# Altium schematic sheet LED Control A0-A3.SchDoc
size A4; Author: Karol Maciaszek
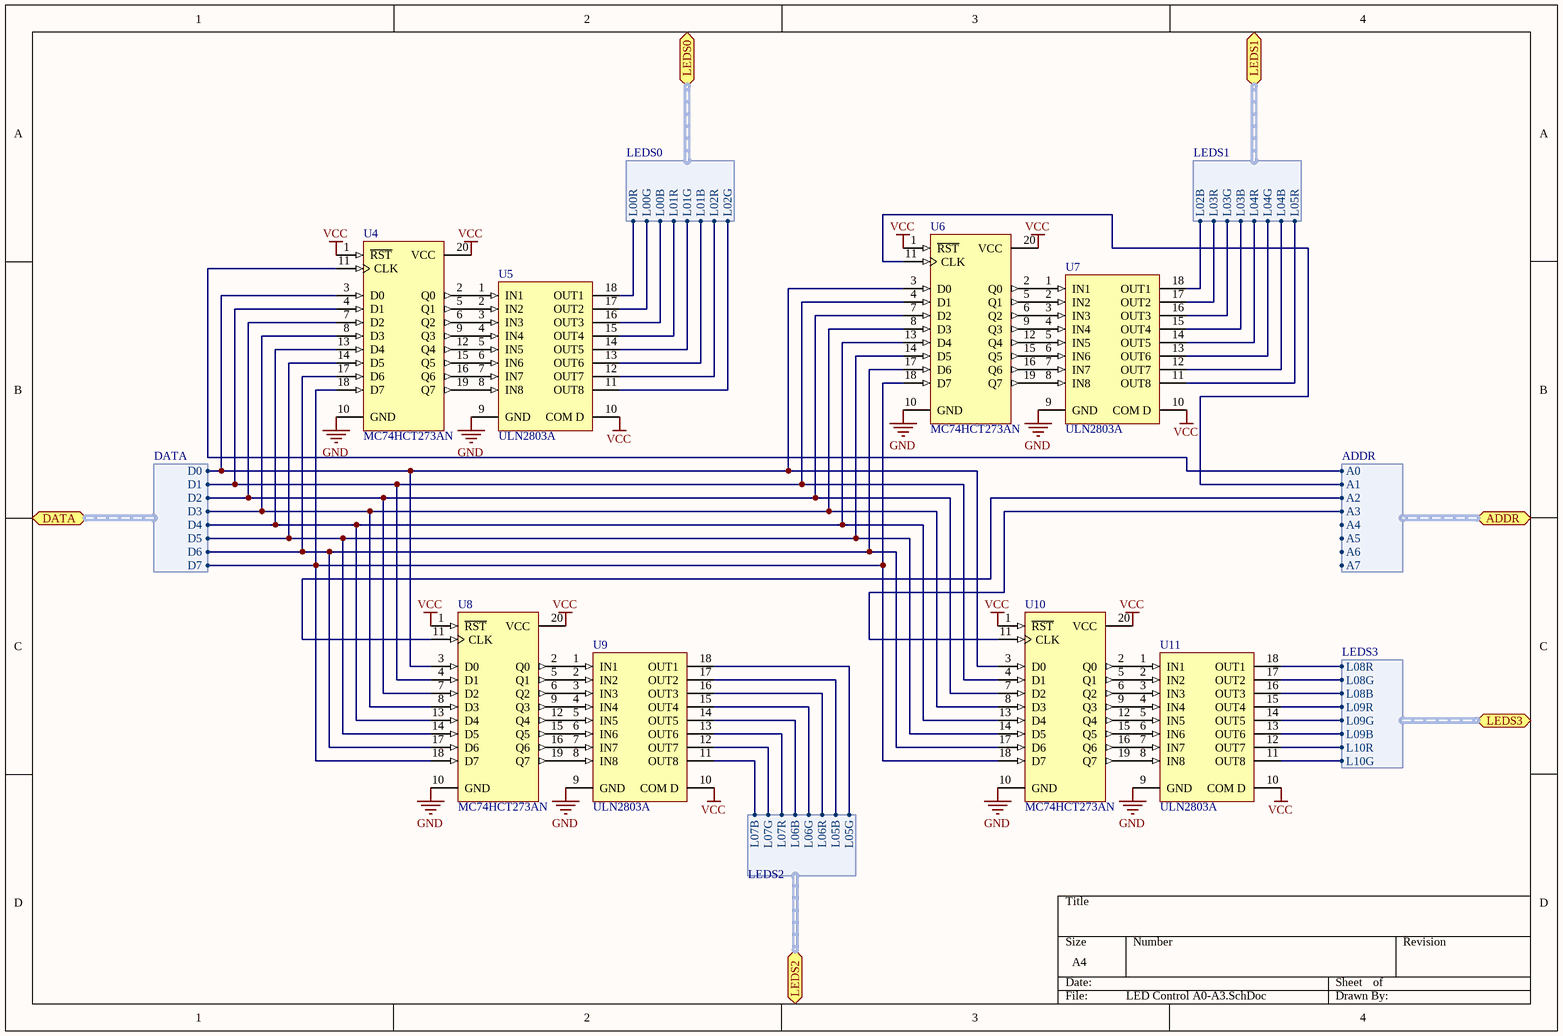
[diagram p0: LED Control A0-A3.SchDoc]

## Parts
U4  MC74HCT273AN  [738-03]
U5  ULN2803A  [DIP18]
U6  MC74HCT273AN  [738-03]
U7  ULN2803A  [DIP18]
U8  MC74HCT273AN  [738-03]
U9  ULN2803A  [DIP18]
U10  MC74HCT273AN  [738-03]
U11  ULN2803A  [DIP18]

## Ports
ADDR (harness ADDR), DATA (harness DATA), LEDS0 (harness LEDS0), LEDS1 (harness LEDS1), LEDS2 (harness LEDS2), LEDS3 (harness LEDS3)

## Harnesses
DATA: D7, D6, D5, D4, D3, D2, D1, D0
ADDR: A7, A6, A5, A4, A3, A2, A1, A0
LEDS0: L00R, L00G, L00B, L01R, L01G, L01B, L02R, L02G
LEDS1: L02B, L03R, L03G, L03B, L04R, L04G, L04B, L05R
LEDS2: L05G, L05B, L06R, L06G, L06B, L07R, L07G, L07B
LEDS3: L08R, L08G, L08B, L09R, L09G, L09B, L10R, L10G

## Nets
GND: U4.10(GND) U5.9(GND) U6.10(GND) U7.9(GND) U8.10(GND) U9.9(GND) U10.10(GND) U11.9(GND)
VCC: U4.1(~{RST}) U4.20(VCC) U5.10(COM_D) U6.1(~{RST}) U6.20(VCC) U7.10(COM_D) U8.1(~{RST}) U8.20(VCC) U9.10(COM_D) U10.1(~{RST}) U10.20(VCC) U11.10(COM_D)
NetU4_2: U4.2(Q0) U5.1(IN1)
NetU4_3: U4.3(D0) U6.3(D0) U8.3(D0) U10.3(D0) ; port DATA.D0
NetU4_4: U4.4(D1) U6.4(D1) U8.4(D1) U10.4(D1) ; port DATA.D1
NetU4_5: U4.5(Q1) U5.2(IN2)
NetU4_6: U4.6(Q2) U5.3(IN3)
NetU4_7: U4.7(D2) U6.7(D2) U8.7(D2) U10.7(D2) ; port DATA.D2
NetU4_8: U4.8(D3) U6.8(D3) U8.8(D3) U10.8(D3) ; port DATA.D3
NetU4_9: U4.9(Q3) U5.4(IN4)
NetU4_11: U4.11(CLK) ; port ADDR.A0
NetU4_12: U4.12(Q4) U5.5(IN5)
NetU4_13: U4.13(D4) U6.13(D4) U8.13(D4) U10.13(D4) ; port DATA.D4
NetU4_14: U4.14(D5) U6.14(D5) U8.14(D5) U10.14(D5) ; port DATA.D5
NetU4_15: U4.15(Q5) U5.6(IN6)
NetU4_16: U4.16(Q6) U5.7(IN7)
NetU4_17: U4.17(D6) U6.17(D6) U8.17(D6) U10.17(D6) ; port DATA.D6
NetU4_18: U4.18(D7) U6.18(D7) U8.18(D7) U10.18(D7) ; port DATA.D7
NetU4_19: U4.19(Q7) U5.8(IN8)
NetU5_11: U5.11(OUT8) ; port LEDS0.L02G
NetU5_12: U5.12(OUT7) ; port LEDS0.L02R
NetU5_13: U5.13(OUT6) ; port LEDS0.L01B
NetU5_14: U5.14(OUT5) ; port LEDS0.L01G
NetU5_15: U5.15(OUT4) ; port LEDS0.L01R
NetU5_16: U5.16(OUT3) ; port LEDS0.L00B
NetU5_17: U5.17(OUT2) ; port LEDS0.L00G
NetU5_18: U5.18(OUT1) ; port LEDS0.L00R
NetU6_2: U6.2(Q0) U7.1(IN1)
NetU6_5: U6.5(Q1) U7.2(IN2)
NetU6_6: U6.6(Q2) U7.3(IN3)
NetU6_9: U6.9(Q3) U7.4(IN4)
NetU6_11: U6.11(CLK) ; port ADDR.A1
NetU6_12: U6.12(Q4) U7.5(IN5)
NetU6_15: U6.15(Q5) U7.6(IN6)
NetU6_16: U6.16(Q6) U7.7(IN7)
NetU6_19: U6.19(Q7) U7.8(IN8)
NetU7_11: U7.11(OUT8) ; port LEDS1.L05R
NetU7_12: U7.12(OUT7) ; port LEDS1.L04B
NetU7_13: U7.13(OUT6) ; port LEDS1.L04G
NetU7_14: U7.14(OUT5) ; port LEDS1.L04R
NetU7_15: U7.15(OUT4) ; port LEDS1.L03B
NetU7_16: U7.16(OUT3) ; port LEDS1.L03G
NetU7_17: U7.17(OUT2) ; port LEDS1.L03R
NetU7_18: U7.18(OUT1) ; port LEDS1.L02B
NetU8_2: U8.2(Q0) U9.1(IN1)
NetU8_5: U8.5(Q1) U9.2(IN2)
NetU8_6: U8.6(Q2) U9.3(IN3)
NetU8_9: U8.9(Q3) U9.4(IN4)
NetU8_11: U8.11(CLK) ; port ADDR.A2
NetU8_12: U8.12(Q4) U9.5(IN5)
NetU8_15: U8.15(Q5) U9.6(IN6)
NetU8_16: U8.16(Q6) U9.7(IN7)
NetU8_19: U8.19(Q7) U9.8(IN8)
NetU9_11: U9.11(OUT8) ; port LEDS2.L07B
NetU9_12: U9.12(OUT7) ; port LEDS2.L07G
NetU9_13: U9.13(OUT6) ; port LEDS2.L07R
NetU9_14: U9.14(OUT5) ; port LEDS2.L06B
NetU9_15: U9.15(OUT4) ; port LEDS2.L06G
NetU9_16: U9.16(OUT3) ; port LEDS2.L06R
NetU9_17: U9.17(OUT2) ; port LEDS2.L05B
NetU9_18: U9.18(OUT1) ; port LEDS2.L05G
NetU10_2: U10.2(Q0) U11.1(IN1)
NetU10_5: U10.5(Q1) U11.2(IN2)
NetU10_6: U10.6(Q2) U11.3(IN3)
NetU10_9: U10.9(Q3) U11.4(IN4)
NetU10_11: U10.11(CLK) ; port ADDR.A3
NetU10_12: U10.12(Q4) U11.5(IN5)
NetU10_15: U10.15(Q5) U11.6(IN6)
NetU10_16: U10.16(Q6) U11.7(IN7)
NetU10_19: U10.19(Q7) U11.8(IN8)
NetU11_11: U11.11(OUT8) ; port LEDS3.L10G
NetU11_12: U11.12(OUT7) ; port LEDS3.L10R
NetU11_13: U11.13(OUT6) ; port LEDS3.L09B
NetU11_14: U11.14(OUT5) ; port LEDS3.L09G
NetU11_15: U11.15(OUT4) ; port LEDS3.L09R
NetU11_16: U11.16(OUT3) ; port LEDS3.L08B
NetU11_17: U11.17(OUT2) ; port LEDS3.L08G
NetU11_18: U11.18(OUT1) ; port LEDS3.L08R

## Library data of the parts
U4 U6 U8 U10 = MC74HCT273AN: Octal D-Type Flip-Flop with Common Clock and Reset with LSTTL-Compatible Inputs; Published: 15-Apr-2002; DatasheetVersion: Mar-2000; PackageVersion: 1996; PackageReference: 738-03; Publisher: Altium Limited; PackageDescription: DIP; 20 Leads; Row Spacing 7.62 mm; Pitch 2.54 mm; Code_JEDEC: MS-001-AD; ComponentLink1Description: Manufacturer Link; ComponentLink1URL: http://www.onsemi.com/; ComponentLink2Description: Datasheet; ComponentLink2URL: http://www.onsemi.com/pub/Collateral/MC74HCT273A-D.PDF
U5 U7 U9 U11 = ULN2803A: Eight Darlington Array; Published: 8-Jun-2000; LatestRevisionDate: 06-Jun-2005; LatestRevisionNote: Stylized 3D Model Added.; DatasheetVersion: Sep-1997; PackageReference: DIP18; Publisher: Altium Limited; PackageDescription: DIP; 18 Leads; Row Spacing 7.62 mm; Pitch 2.54 mm; ComponentLink1Description: Manufacturer Link; ComponentLink1URL: http://www.st.com/; ComponentLink2Description: Datasheet; ComponentLink2URL: http://www.st.com/stonline/products/literature/ds/1536/uln2801a.pdf